# EAGLE design wemos_sense (EAGLE 9.6.2)
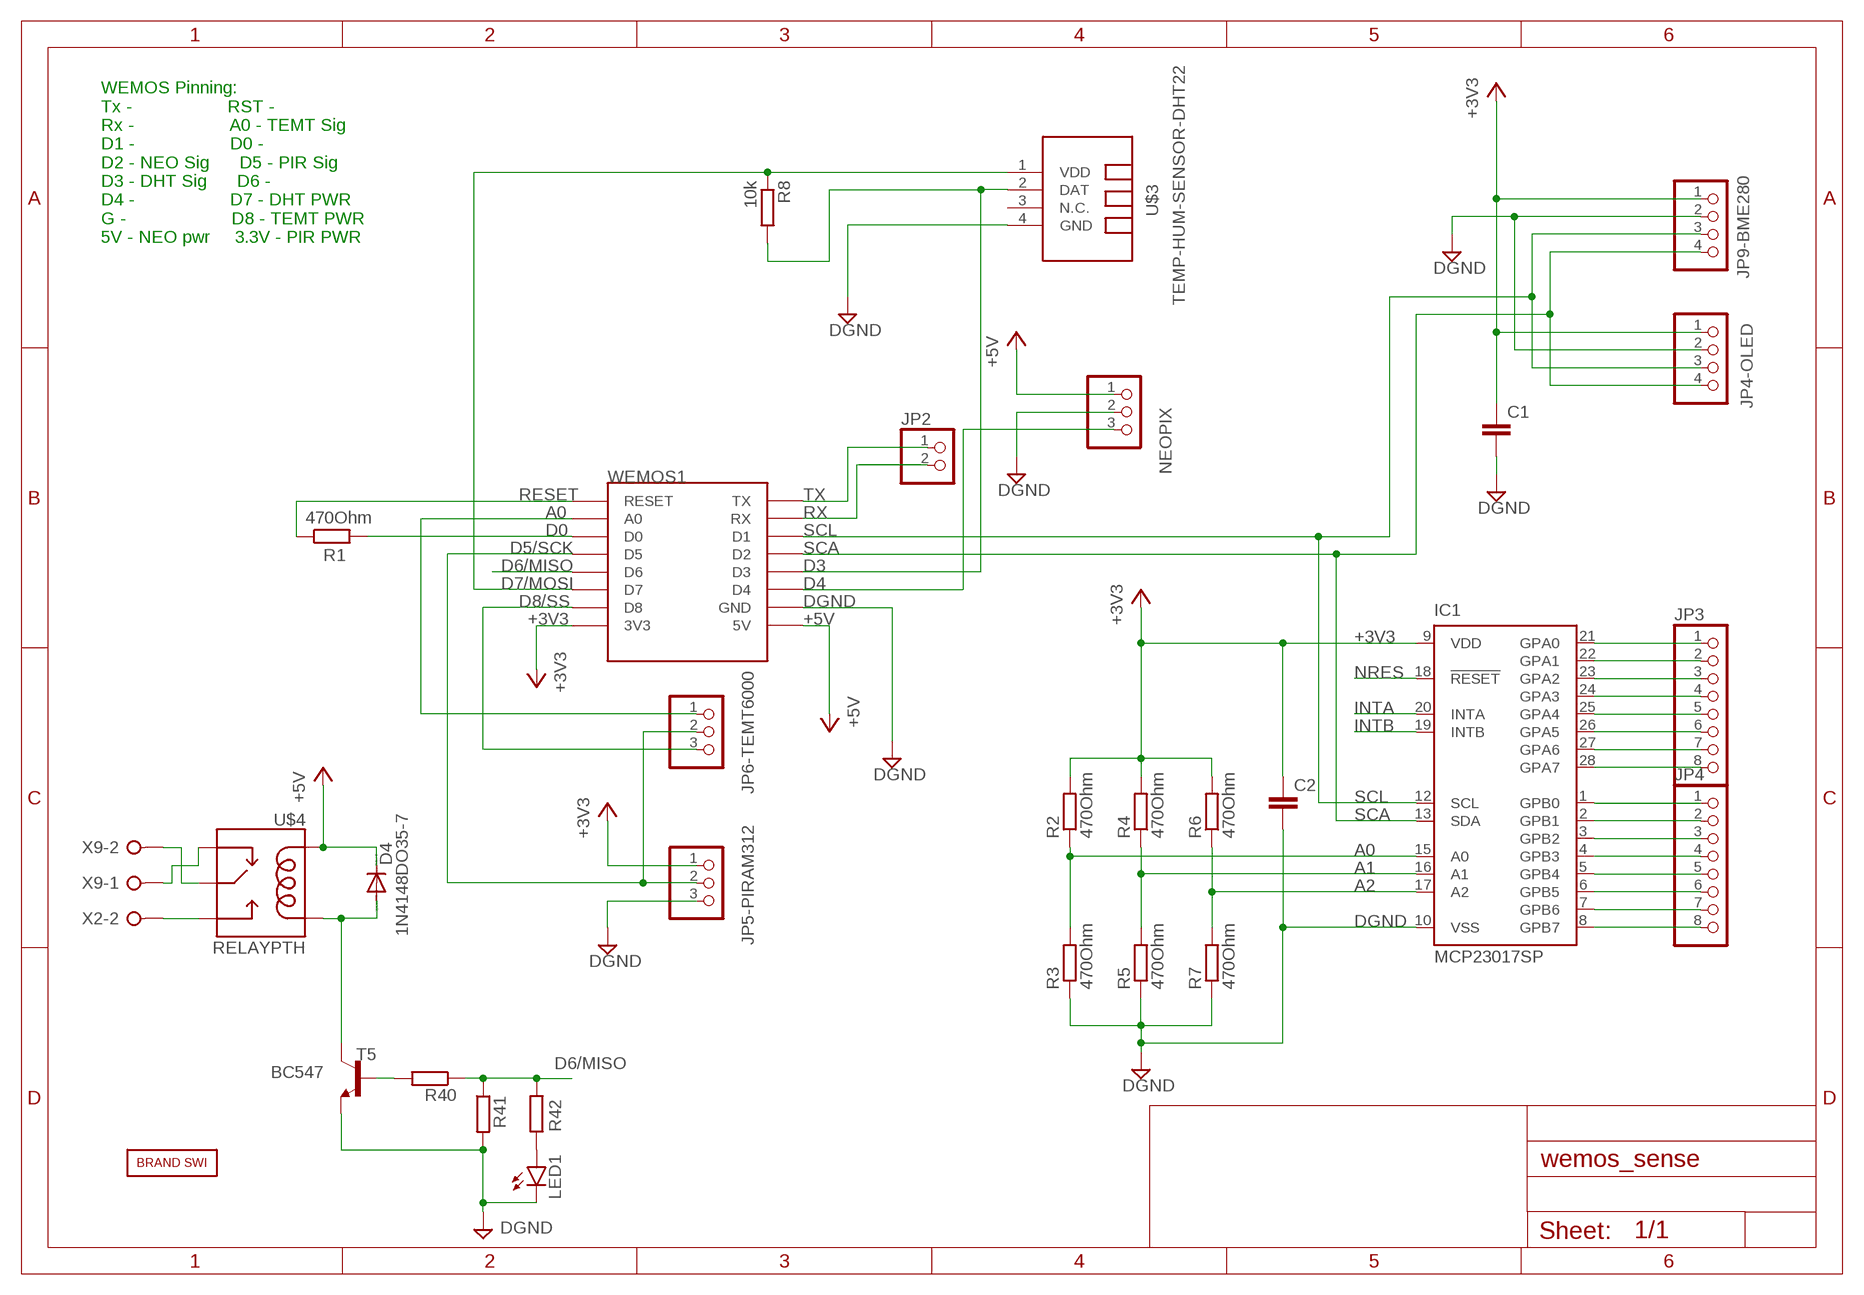
[diagram p0: schematic, sheet 1]

## Parts
C1  C-EUC1210  [C1210]
C2  C-EUC1210  [C1210]
D4  1N4148DO35-7  [DO35-7]
IC1  MCP23017SP  [DIL28-3]
JP2  PINHD-1X2  [1X02]
JP3  PINHD-1X8  [1X08]
JP4  PINHD-1X8  [1X08]
JP4-OLED  PINHD-1X4  [1X04]
JP5-PIRAM312  PINHD-1X3  [1X03]
JP6-TEMT6000  PINHD-1X3  [1X03]
JP9-BME280  PINHD-1X4  [1X04]
LED1  LED3MM  [LED3MM]
NEOPIX  PINHD-1X3  [1X03]
R1  470Ohm  R-EU_R0805  [R0805]
R2  470Ohm  R-EU_R0805  [R0805]
R3  470Ohm  R-EU_R0805  [R0805]
R4  470Ohm  R-EU_R0805  [R0805]
R5  470Ohm  R-EU_R0805  [R0805]
R6  470Ohm  R-EU_R0805  [R0805]
R7  470Ohm  R-EU_R0805  [R0805]
R8  10k  R-EU_R0805  [R0805]
R40  R-EU_R0805  [R0805]
R41  R-EU_R0805  [R0805]
R42  R-EU_R0805  [R0805]
T5  BC547  [TO92]
U$2  BRAND_SWI5X7  [BRAND_SWI_5X7]
U$3  TEMP-HUM-SENSOR-DHT22  [TEMP-HUM-SENSOR-DHT22]
U$4  RELAYPTH  [SRD-05VDC-SL-C]
WEMOS1  WEMOS-D1-MINI  [WEMOS-D1-MINI]
X2  W237-02P  [W237-132]
X9  W237-02P  [W237-132]

## Nets
+3V3: C1.1 C2.1 IC1.9(VDD) JP4-OLED.1 JP5-PIRAM312.1 JP9-BME280.1 R2.2 R4.2 R6.2 WEMOS1.3V3
+5V: D4.C NEOPIX.1 U$4.COIL1 WEMOS1.5V
A0: IC1.15(A0) JP6-TEMT6000.1 R2.1 R3.2 WEMOS1.A0
A1: IC1.16(A1) R4.1 R5.2
A2: IC1.17(A2) R6.1 R7.2
D0: R1.2 WEMOS1.D0
D3: R8.2 U$3.2(DAT) WEMOS1.D3
D4: NEOPIX.3 WEMOS1.D4
D5/SCK: JP5-PIRAM312.2 JP6-TEMT6000.2 WEMOS1.D5
D6/MISO: R40.1 R41.1 R42.2 WEMOS1.D6
D7/MOSI: R8.1 U$3.1(VDD) WEMOS1.D7
D8/SS: JP6-TEMT6000.3 WEMOS1.D8
DGND: C1.2 C2.2 IC1.10(VSS) JP4-OLED.2 JP5-PIRAM312.3 JP9-BME280.2 LED1.K(C) NEOPIX.2 R3.1 R5.1 R7.1 R41.2 T5.1(E) U$3.4(GND) WEMOS1.GND
INTA: IC1.20(INTA)
INTB: IC1.19(INTB)
N$1: IC1.21(GPA0) JP3.1
N$2: IC1.22(GPA1) JP3.2
N$3: IC1.23(GPA2) JP3.3
N$4: IC1.24(GPA3) JP3.4
N$5: IC1.25(GPA4) JP3.5
N$6: IC1.26(GPA5) JP3.6
N$7: IC1.27(GPA6) JP3.7
N$8: IC1.28(GPA7) JP3.8
N$9: IC1.1(GPB0) JP4.1
N$10: IC1.2(GPB1) JP4.2
N$11: IC1.3(GPB2) JP4.3
N$12: IC1.4(GPB3) JP4.4
N$13: IC1.5(GPB4) JP4.5
N$14: IC1.6(GPB5) JP4.6
N$15: IC1.7(GPB6) JP4.7
N$16: IC1.8(GPB7) JP4.8
N$17: U$4.SWCOMMON X9.2
N$18: U$4.SWCLOSED(SWCLOSE) X9.1
N$19: LED1.A R42.1
N$22: D4.A T5.3(C) U$4.COIL0
N$25: U$4.SWOPEN X2.2
N$27: R40.2 T5.2(B)
NRES: IC1.18(!RESET)
RESET: R1.1 WEMOS1.RESET
RX: JP2.2 WEMOS1.RX
SCA: IC1.13(SDA) JP4-OLED.4 JP9-BME280.4 WEMOS1.D2
SCL: IC1.12(SCL) JP4-OLED.3 JP9-BME280.3 WEMOS1.D1
TX: JP2.1 WEMOS1.TX
Unconnected: U$3.3(N.C.) X2.1

## Notes on the sheet
- WEMOS Pinning:
  Tx -                   RST - 
  Rx -                   A0 - TEMT Sig
  D1 -                   D0 - 
  D2 - NEO Sig      D5 - PIR Sig
  D3 - DHT Sig      D6 - 
  D4 -                   D7 - DHT PWR
  G -                     D8 - TEMT PWR
  5V - NEO pwr     3.3V - PIR PWR

## Library data of the parts
C1 C2 = rcl:C-EU: CAPACITOR, European symbol
D4 = diode:1N4148: DIODE high speed (Philips)
IC1 = SWI_COMMONS:MCP23017: http://ww1.microchip.com/downloads/en/DeviceDoc/21952a.pdf Source: http://ww1.microchip.com/downloads/en/DeviceDoc/21952a.pdf; MF: MICROCHIP; MPN: MCP23017-E/SP; OC_FARNELL: 1332088; OC_NEWARK: 31K2959
JP2 = pinhead:PINHD-1X2: PIN HEADER
JP3 JP4 = pinhead:PINHD-1X8: PIN HEADER
JP4-OLED JP9-BME280 = pinhead:PINHD-1X4: PIN HEADER
JP5-PIRAM312 JP6-TEMT6000 NEOPIX = pinhead:PINHD-1X3: PIN HEADER
LED1 = led:LED: LED OSRAM: - CHIPLED LG R971, LG N971, LY N971, LG Q971, LY Q971, LO R971, LY R971 LH N974, LH R974 LS Q976, LO Q976, LY Q976 LO Q996 - Hyper CHIPLED LW Q18S LB Q993, LB Q99A, LB R99A - SideLED LS A670, LO A670, LY A670, LG A670, LP A670 LB A673, LV A673, LT A673, LW A673 LH A674 LY A675 LS A676, LA A676, LO A676, LY A676, LW A676 LS A679, LY A679, LG A679 - Hyper Micro SIDELED® LS Y876, LA Y876, LO Y876, LY Y876 LT Y87S - SmartLED LW L88C, LW L88S LB L89C, LB L89S, LG L890 LS L89K, LO L89K, LY L89K LS L896, LA L896, LO L896, LY L896 - TOPLED LS T670, LO T670, LY T670, LG T670, LP T670 LSG T670, LSP T670, LSY T670, LOP T670, LYG T670 LG T671, LOG T671, LSG T671 LB T673, LV T673, LT T673, LW T673 LH T674 LS T676, LA T676, LO T676, LY T676, LB T676, LH T676, LSB T676, LW T676 LB T67C, LV T67C, LT T67C, LS T67K, LO T67K, LY T67K, LW E67C LS E67B, LA E67B, LO E67B, LY E67B, LB E67C, LV E67C, LT E67C LW T67C LS T679, LY T679, LG T679 LS T770, LO T770, LY T770, LG T770, LP T770 LB T773, LV T773, LT T773, LW T773 LH T774 LS E675, LA E675, LY E675, LS T675 LS T776, LA T776, LO T776, LY T776, LB T776 LHGB T686 LT T68C, LB T68C - Hyper Mini TOPLED® LB M676 - Mini TOPLED Santana® LG M470 LS M47K, LO M47K, LY M47K Source: http://www.osram.convergy.de LUXEON: - LUMILED® LXK2-PW12-R00, LXK2-PW12-S00, LXK2-PW14-U00, LXK2-PW14-V00 LXK2-PM12-R00, LXK2-PM12-S00, LXK2-PM14-U00 LXK2-PE12-Q00, LXK2-PE12-R00, LXK2-PE12-S00, LXK2-PE14-T00, LXK2-PE14-U00 LXK2-PB12-K00, LXK2-PB12-L00, LXK2-PB12-M00, LXK2-PB14-N00, LXK2-PB14-P00, LXK2-PB14-Q00 LXK2-PR12-L00, LXK2-PR12-M00, LXK2-PR14-Q00, LXK2-PR14-R00 LXK2-PD12-Q00, LXK2-PD12-R00, LXK2-PD12-S00 LXK2-PH12-R00, LXK2-PH12-S00 LXK2-PL12-P00, LXK2-PL12-Q00, LXK2-PL12-R00 Source: www.luxeon.com KINGBRIGHT: KA-3528ASYC Source: www.kingbright.com
R1-R8 R40-R42 = rcl:R-EU_: RESISTOR, European symbol
T5 = transistor:BC547: NPN TRANSISTOR
U$2 = BRAND_SWI:BRAND_SWI
U$3 = SWI_COMMONS:TEMP-HUM-SENSOR-DHT22: DHT22 - digital humidity & temperature sensor Also known as: AM2302 AM2302 datasheet available here: http://akizukidenshi.com/download/ds/aosong/AM2302.pdf Click here to find device on ebay.com <http://www.ebay.com/sch/dht22+digital+sensor>
U$4 = SRD-05VDC-SL-C:RELAY: SPDT relay (COM-00101)
WEMOS1 = SWI_COMMONS:WEMOS-D1-MINI: WeMos.cc D1 mini ESP8266 module
X2 X9 = con-wago-508:W237-02P: WAGO SREW CLAMP; OC_FARNELL: unknown; OC_NEWARK: unknown

## Board
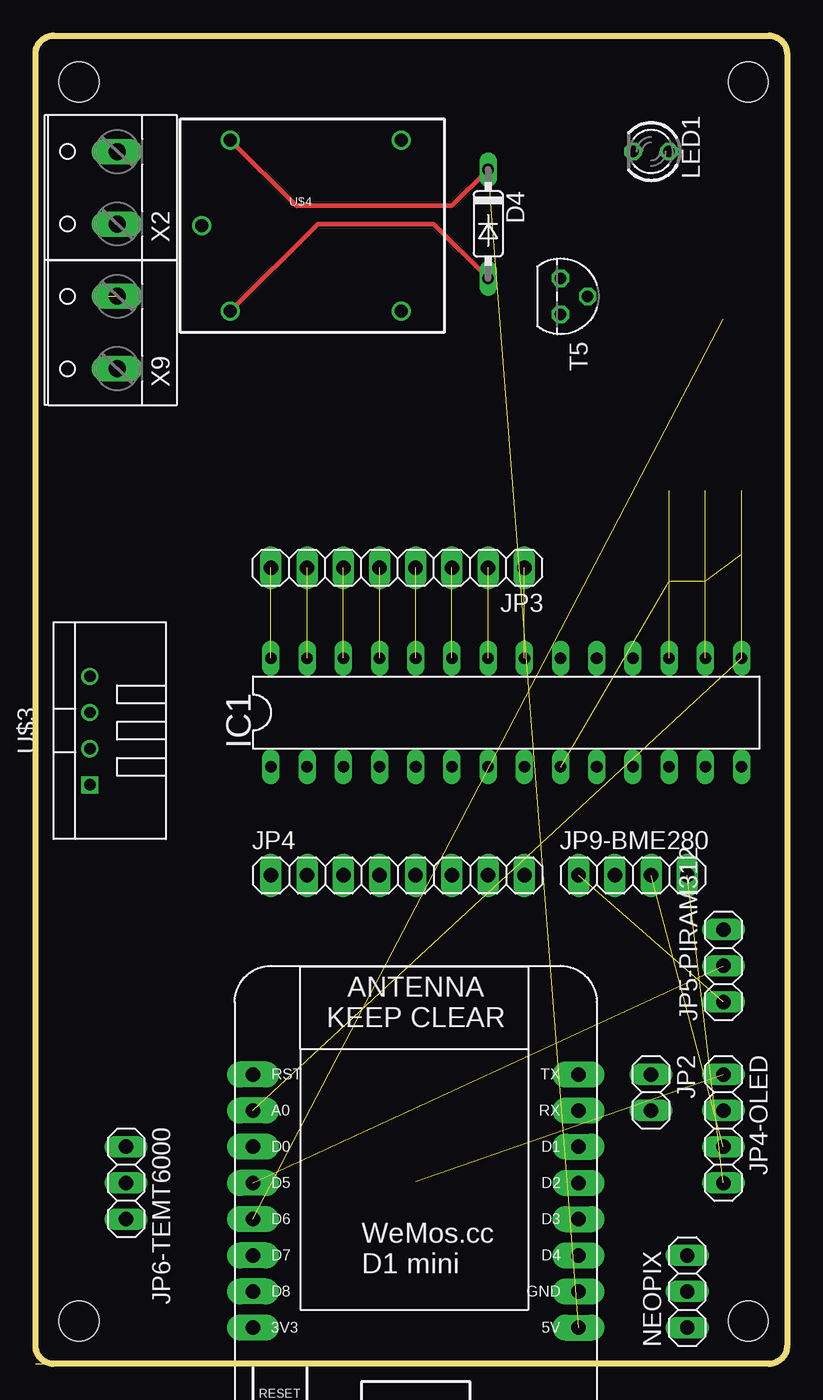
[diagram p1: board, top side]
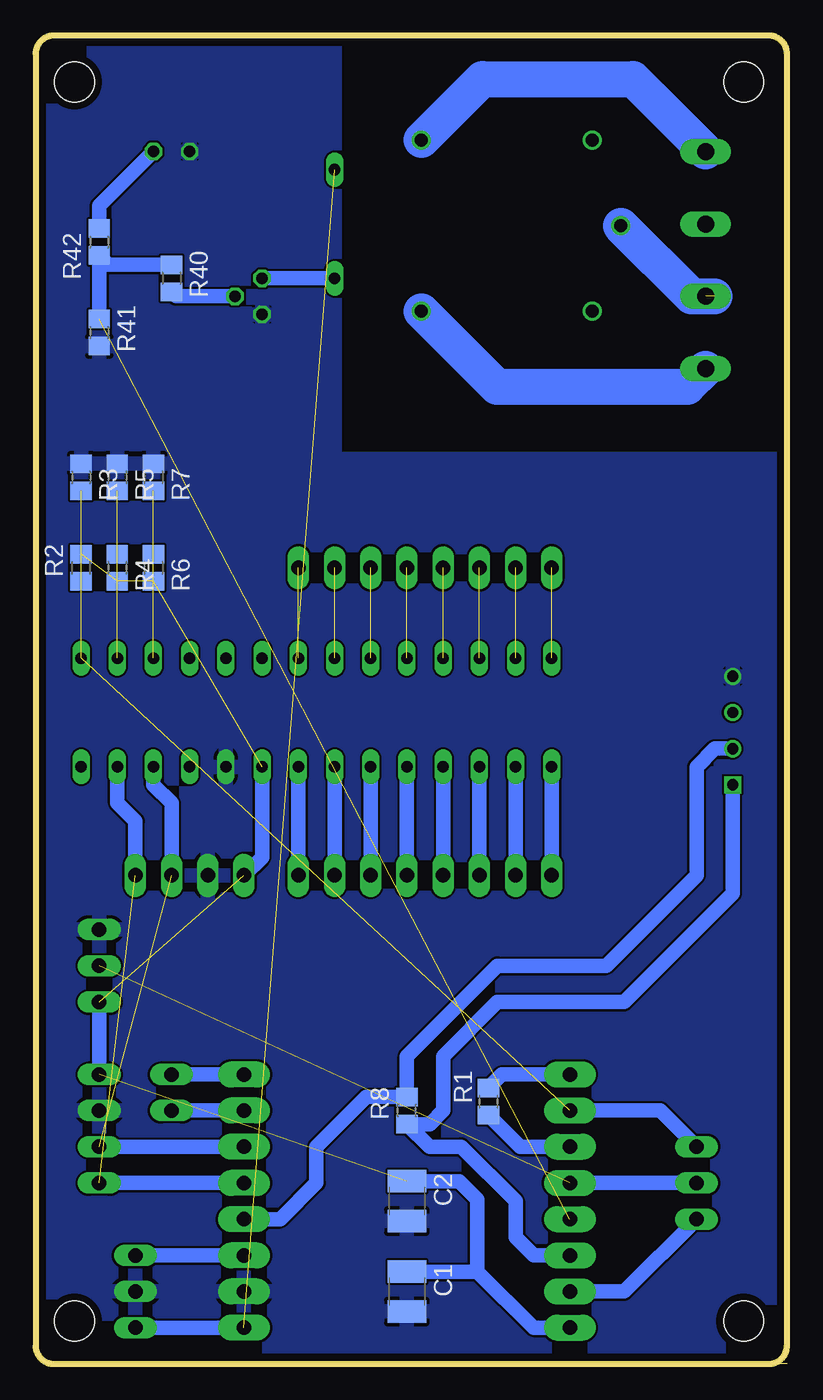
[diagram p2: board, bottom side, seen from below]

Size 52.72 x 93.23 mm. Coordinates in mm from the lower left corner, seen from the top.
Outline: 0,0 1.27,0
Outline: 1.27,0 2.03,0
Outline: 28.45,0 31.42,0
Outline: 1.27,0 51.45,0 arc90 52.72,1.27 52.72,91.96 arc90 51.45,93.23 1.27,93.23 arc90 0,91.96 0,1.27 arc90 1.27,0
Copper layers (1*16): Top 0.035mm / dielectric 1.6mm / Bottom 0.035mm
Design rules "Elecrow_2-layer_PCB_eagle_rule *": minimum track width 12mil, minimum drill 12mil, track to track 6mil, track to pad 6mil, pad to pad 6mil, via to via 8mil, smd to smd 0mil, copper to edge 20mil, drill to drill 10mil, minimum pad ring 6mil, minimum via ring 6mil, stop-mask expansion 0mil, vias tented up to drill 100mil, thermal gap 10mil
Holes 2.8 mm at 3.04,89.97 50,89.97 50,3.01 3.04,3.01
bKeepout: area 0,64.8 to 30.5,92.7

### Footprints (pad centres in the part's own frame; a part is rotated, then mirrored left to right if it is on the bottom)
C1210 = smd 1.6 x 2.7: 1 -1.4,0; 2 1.4,0
DO35-7 = drill 0.813 long: A 3.81,0; C -3.81,0
DIL28-3 = drill 0.813 long: 1 -16.51,-3.81; 2 -13.97,-3.81; 3 -11.43,-3.81; 4 -8.89,-3.81; 5 -6.35,-3.81; 6 -3.81,-3.81; 7 -1.27,-3.81; 8 1.27,-3.81; 9 3.81,-3.81; 10 6.35,-3.81; 11 8.89,-3.81; 12 11.43,-3.81; 13 13.97,-3.81; 14 16.51,-3.81; 15 16.51,3.81; 16 13.97,3.81; 17 11.43,3.81; 18 8.89,3.81; 19 6.35,3.81; 20 3.81,3.81; 21 1.27,3.81; 22 -1.27,3.81; 23 -3.81,3.81; 24 -6.35,3.81; 25 -8.89,3.81; 26 -11.43,3.81; 27 -13.97,3.81; 28 -16.51,3.81
1X02 = drill 1.016 long: 1 -1.27,0; 2 1.27,0
1X08 = drill 1.016 long: 1 -8.89,0; 2 -6.35,0; 3 -3.81,0; 4 -1.27,0; 5 1.27,0; 6 3.81,0; 7 6.35,0; 8 8.89,0
1X04 = drill 1.016 long: 1 -3.81,0; 2 -1.27,0; 3 1.27,0; 4 3.81,0
1X03 = drill 1.016 long: 1 -2.54,0; 2 0,0; 3 2.54,0
LED3MM = drill 0.813 octagon: A -1.27,0; K 1.27,0
R0805 = smd 1.3 x 1.5: 1 -0.95,0; 2 0.95,0
TO92 = drill 0.813 octagon: 1 1.27,0; 2 0,1.905; 3 -1.27,0
TEMP-HUM-SENSOR-DHT22 = drill 0.8 square: 1 -3.81,0 | drill 0.8: 2 -1.27,0; 3 1.27,0; 4 3.81,0
SRD-05VDC-SL-C = drill 0.9: COIL0 -5.39,-6.12; COIL1 -5.39,5.88; SWCLOSED 6.61,-6.12; SWCOMMON -7.39,-0.12; SWOPEN 6.61,5.88
WEMOS-D1-MINI = drill 1.016 pad 1.829 long: 3V3 -10.16,-10.16; 5V 12.7,-10.16; A0 -10.16,5.08; D0 -10.16,2.54; D1 12.7,2.54; D2 12.7,0; D3 12.7,-2.54; D4 12.7,-5.08; D5 -10.16,0; D6 -10.16,-2.54; D7 -10.16,-5.08; D8 -10.16,-7.62; GND 12.7,-7.62; RESET -10.16,7.62; RX 12.7,5.08; TX 12.7,7.62
W237-132 = drill 1.194 long: 1 -2.54,-0.635; 2 2.54,-0.635

### Placement (x,y rotation side)
C1  26.67,5.08 270 bottom
C2  26.67,11.43 270 bottom
D4  31.75,80.01 270 top
IC1  33.02,45.72 0 top
JP2  43.18,19.05 270 top
JP3  25.4,55.88 180 top
JP4  25.4,34.29 0 top
JP4-OLED  48.26,16.51 270 top
JP5-PIRAM312  48.26,27.94 90 top
JP6-TEMT6000  6.35,12.7 270 top
JP9-BME280  41.91,34.29 0 top
LED1  43.18,85.09 180 top
NEOPIX  45.72,5.08 90 top
R1  20.95,18.41 270 bottom
R2  49.53,55.88 90 bottom
R3  49.53,62.23 270 bottom
R4  46.99,55.88 270 bottom
R5  46.99,62.23 270 bottom
R6  44.45,55.88 270 bottom
R7  44.45,62.23 270 bottom
R8  26.67,17.78 90 bottom
R40  43.18,76.2 270 bottom
R41  48.26,72.39 270 bottom
R42  48.26,78.74 270 bottom
T5  36.83,74.93 270 top
U$2  -26.8,72.39 0 top  (outside the outline)
U$3  3.81,44.45 90 top
U$4  19.05,80.01 0 top
WEMOS1  25.4,12.7 0 top
X2  5.08,82.55 90 top
X9  5.08,72.39 90 top

### Tracks (layer width: path | path; a pad name or v marks a point on that pad's centre or on a via)
+3V3  (5 unrouted)
  Bottom 1.016: C1.1 21.72,6.48 | WEMOS1.3V3 17.78,2.54 21.72,6.48 | 21.72,6.48 21.72,11.56 22.99,12.83 C2.1 | JP9-BME280.1 36.83,35.56 IC1.9 | JP5-PIRAM312.1 JP4-OLED.1
+5V  (1 unrouted)
  Top 0.305: U$4.COIL1 18.27,81.28 29.21,81.28 D4.C
  Bottom 1.016: NEOPIX.1 WEMOS1.5V
A0  (3 unrouted)
  Bottom 1.016: WEMOS1.A0 8.89,17.78 JP6-TEMT6000.1
A1  (2 unrouted)
A2  (2 unrouted)
D0
  Bottom 1.016: R1.2 18.73,15.24 WEMOS1.D0
D3
  Bottom 1.016: WEMOS1.D3 35.56,10.16 33.02,12.7 33.02,15.24 29.53,18.73 R8.2 26.67,21.59 20.32,27.94 12.7,27.94 6.35,34.29 6.35,41.91 5.08,43.18 U$3.2
D4
  Bottom 1.016: NEOPIX.3 WEMOS1.D4
D5/SCK  (1 unrouted)
  Bottom 1.016: WEMOS1.D5 JP6-TEMT6000.2
D6/MISO  (1 unrouted)
  Bottom 1.016: R40.1 47.62,77.15 R42.2 R41.1
D7/MOSI
  Bottom 1.016: WEMOS1.D7 17.78,7.62 19.05,8.89 19.05,11.43 22.86,15.24 25.08,15.24 R8.1 25.08,16.83 24.13,17.78 24.13,21.59 20.32,25.4 11.43,25.4 3.81,33.02 U$3.1
D8/SS
  Bottom 1.016: WEMOS1.D8 11.43,5.08 JP6-TEMT6000.3
DGND
  pour Bottom: 0,63.5 31.75,63.5 31.75,92.71 52.07,92.71 52.07,1.27 52.07,0 0,0
N$1  (1 unrouted)
N$2  (1 unrouted)
N$3  (1 unrouted)
N$4  (1 unrouted)
N$5  (1 unrouted)
N$6  (1 unrouted)
N$7  (1 unrouted)
N$8  (1 unrouted)
N$9
  Bottom 1.016: IC1.1 JP4.1
N$10
  Bottom 1.016: JP4.2 IC1.2
N$11
  Bottom 1.016: IC1.3 JP4.3
N$12
  Bottom 1.016: IC1.4 JP4.4
N$13
  Bottom 1.016: IC1.5 JP4.5
N$14
  Bottom 1.016: JP4.6 IC1.6
N$15
  Bottom 1.016: IC1.7 JP4.7
N$16
  Bottom 1.016: IC1.8 JP4.8
N$17  (1 unrouted)
  Bottom 2.54: U$4.SWCOMMON 6.7,74.93 5.08,74.93
N$18
  Bottom 2.54: U$4.SWCLOSED 20.35,68.58 6.99,68.58 X9.1
N$19
  Bottom 1.016: R42.1 48.26,81.28 LED1.A
N$22
  Top 0.305: U$4.COIL0 19.78,80.01 27.94,80.01 D4.A
  Bottom 1.016: T5.3 D4.A
N$25
  Bottom 2.54: U$4.SWOPEN 21.38,90.17 10.79,90.17 X2.2
N$27
  Bottom 1.016: R40.2 42.86,74.93 T5.2
RESET
  Bottom 1.016: R1.1 20,20.32 WEMOS1.RESET
RX
  Bottom 1.016: JP2.2 WEMOS1.RX
SCA  (1 unrouted)
  Bottom 1.016: JP4-OLED.4 WEMOS1.D2 | JP9-BME280.4 45.72,38.1 46.99,39.37 IC1.13
SCL  (1 unrouted)
  Bottom 1.016: JP4-OLED.3 WEMOS1.D1 | JP9-BME280.3 43.18,39.37 44.45,40.64 IC1.12
TX
  Bottom 1.016: JP2.1 WEMOS1.TX

### Text on the board
tNames: WSHIELD_WEMOS_SENSE | PN39021R0B0